# Altium schematic sheet sch.schdoc: AT long bus (13.3 x 4.2 inches)
size A; Organization: Organization; Address1: Address1; Address2: Address2; Address3: Address3; Address4: Address4; DocumentNumber: 1; Revision: 0; SheetNumber: 2; SheetTotal: 2
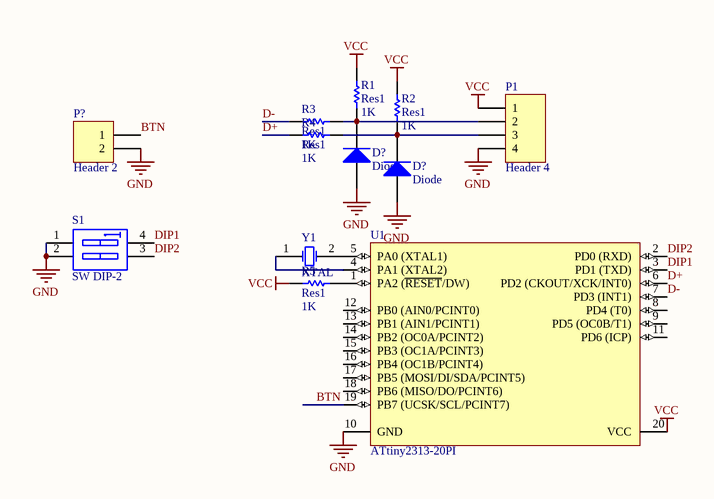
[diagram p0: sch.schdoc]

## Parts
(Parts that share a designator on the sheet are numbered #1, #2 ... from top to bottom, then left to right.)
D?#1  Diode  [SOD80C]
D?#2  Diode  [SOD80C]
P1  Header 4  [HDR1X4]
P?  Header 2  [HDR1X2]
R1  Res1  value 1K  [0603x]
R2  Res1  value 1K  [0603x]
R3  Res1  value 1K  [0603x]
R4  Res1  value 1K  [0603x]
R5  Res1  value 1K  [0603x]
S1  SW DIP-2  [DIP-4]
U1  ATtiny2313-20PI  [20P3]
Y1  XTAL  [CRYSTAL]

## Nets
GND: D?#1.1(A) D?#2.1(A) P1.4 P?.2 S1.1(A1) S1.2(A2) U1.10(GND)
VCC: P1.1 R1.2 R2.2 R5.1 U1.20(VCC)
BTN: P?.1 U1.19(PB7_(UCSK/SCL/PCINT7))
D+: R4.1 U1.6(PD2_(CKOUT/XCK/INT0))
D-: R3.1 U1.7(PD3_(INT1))
DIP1: S1.4(B1) U1.3(PD1_(TXD))
DIP2: S1.3(B2) U1.2(PD0_(RXD))
NetD?#1_2: D?#1.2(K) P1.2 R1.1 R3.2
NetD?#2_2: D?#2.2(K) P1.3 R2.1 R4.2
NetR5_2: R5.2 U1.1(PA2_(~{RESET}/DW))
NetU1_4: U1.4(PA1_(XTAL2)) Y1.1(OSC1)
NetU1_5: U1.5(PA0_(XTAL1)) Y1.2(OSC2)

Not connected (* = marked no-connect by the designer): U1 8(PD4_(T0)) 9(PD5_(OC0B/T1)) 11(PD6_(ICP)) 12(PB0_(AIN0/PCINT0)) 13(PB1_(AIN1/PCINT1)) 14(PB2_(OC0A/PCINT2)) 15(PB3_(OC1A/PCINT3)) 16(PB4_(OC1B/PCINT4)) 17(PB5_(MOSI/DI/SDA/PCINT5)) 18(PB6_(MISO/DO/PCINT6))

## Library data of the parts
D?#1 D?#2 = Diode: Default Diode; Published: 8-Jun-2000; LatestRevisionDate: 17-Jul-2002; LatestRevisionNote: Re-released for DXP Platform.; PackageVersion: Sep-1996; PackageReference: SMC; Publisher: Altium Limited; PackageDescription: DO-214-AB/SMC; 2 C-Bend Leads; Body 7.9 x 5.9 mm, inc. leads (LxW); Code_JEDEC: DO-214-AB
P1 = Header 4: Header, 4-Pin; LatestRevisionDate: 17-Jul-2002; LatestRevisionNote: Re-released for DXP Platform.; Publisher: Altium Limited
P? = Header 2: Header, 2-Pin; LatestRevisionDate: 17-Jul-2002; LatestRevisionNote: Re-released for DXP Platform.; Publisher: Altium Limited
R1-R5 = Res1: Resistor; Published: 8-Jun-2000; LatestRevisionDate: 17-Jul-2002; LatestRevisionNote: Re-released for DXP Platform.; PackageReference: AXIAL-0.3; Publisher: Altium Limited; PackageDescription: Axial Device, Thru-Hole; 2 Leads; 0.3 in Pin Spacing
S1 = SW DIP-2: DIP Switch, 2 Position, SPST; Published: 24-Mar-1999; LatestRevisionDate: 17-Jul-2002; LatestRevisionNote: Re-released for DXP Platform.; PackageReference: DIP-4; Publisher: Altium Limited
U1 = ATtiny2313-20PI: Low Power tinyAVR® 8-Bit Microcontroller, 2K Flash Memory, 20MHz, Industrial Temperature, 20-Lead PDIP; Published: 20-Nov-2009; DatasheetVersion: DOC2543B, Mar-2009; PackageVersion: revC, Jan-2004; PackageReference: 20P3; Publisher: Altium Limited; PackageDescription: 20-lead (0.300"/7.62mm Wide) Plastic Dual Inline Package (PDIP); Supplier 1: Digi-Key; Supplier Part Number 1: ATTINY2313-20PI-ND; Supplier 2: Mouser; Supplier Part Number 2: 556-ATTINY2313-20PI; Code_JEDEC: MS-001-AD; ComponentLink1Description: Manufacturer Link; ComponentLink1URL: http://www.atmel.com/products/AVR/tinyavr.asp?; ComponentLink2Description: Datasheet; ComponentLink2URL: http://www.atmel.com/dyn/resources/prod_documents/doc2543.pdf; ComponentLink3Description: Atmel.com Home; ComponentLink3URL: http://www.atmel.com
Y1 = XTAL: Crystal Oscillator; Published: 8-Jun-2000; LatestRevisionDate: 17-Jul-2002; LatestRevisionNote: Re-released for DXP Platform.; PackageReference: R38; Publisher: Altium Limited; PackageDescription: Crystal, Thru-Hole; 2 Leads; Body 3.1 x 8.2 mm (Dia.xH)